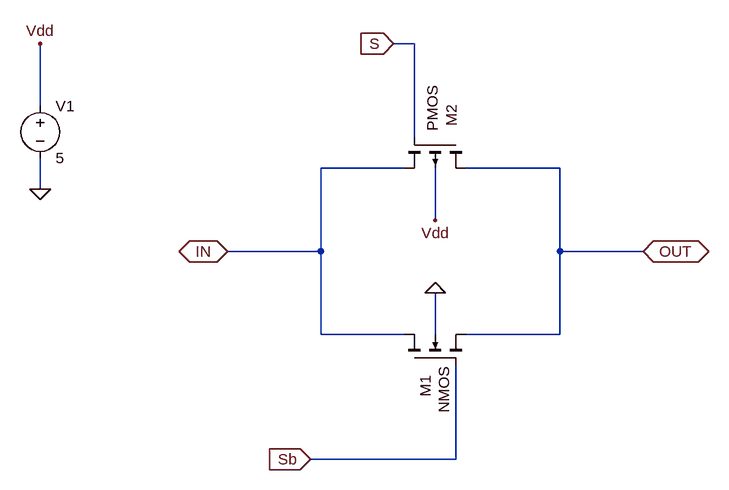
[diagram p0: schematic TG.asc]
TG.asc, the LTspice schematic file:
Version 4
SHEET 1 880 680
WIRE 176 -112 144 -112
WIRE -400 -16 -400 -112
WIRE 176 32 176 -112
WIRE 160 80 32 80
WIRE 400 80 256 80
WIRE -400 112 -400 64
WIRE 208 160 208 80
WIRE 32 208 32 80
WIRE 32 208 -112 208
WIRE 400 208 400 80
WIRE 528 208 400 208
WIRE 32 336 32 208
WIRE 160 336 32 336
WIRE 208 336 208 272
WIRE 400 336 400 208
WIRE 400 336 256 336
WIRE 240 528 240 384
WIRE 240 528 16 528
FLAG 208 272 0
FLAG 208 160 Vdd
FLAG 144 -112 S
IOPIN 144 -112 In
FLAG 16 528 Sb
IOPIN 16 528 In
FLAG -112 208 IN
IOPIN -112 208 BiDir
FLAG 528 208 OUT
IOPIN 528 208 BiDir
FLAG -400 112 0
FLAG -400 -112 Vdd
SYMBOL nmos4 160 384 R270
WINDOW 0 -49 33 Left 2
WINDOW 3 -73 62 Left 2
SYMATTR InstName M1
SYMBOL pmos4 256 32 R90
WINDOW 0 -50 23 Left 2
WINDOW 3 -79 52 Left 2
SYMATTR InstName M2
SYMBOL voltage -400 -32 R0
WINDOW 123 0 0 Left 0
WINDOW 39 0 0 Left 0
SYMATTR InstName V1
SYMATTR Value 5

The netlist it stands for:
* TG.asc
M1 IN Sb OUT 0 NMOS
M2 OUT S IN Vdd PMOS
V1 Vdd 0 5
.model NMOS NMOS
.model PMOS PMOS
.lib standard.mos
.backanno
.end